# Altium project inst.PrjPcb
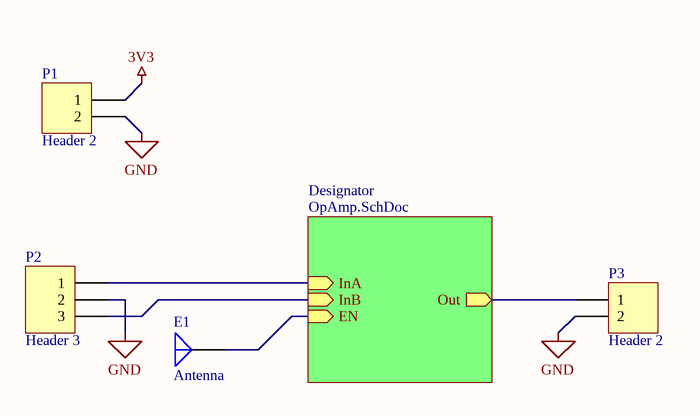
[diagram p0: top.SchDoc]
2 sheets, 38 parts. Net scope: hierarchical (ports join the sheet entries above them; power ports are global).
Board file: PCB1.PcbDoc
Sheets:
  top.SchDoc
    Designator = OpAmp.SchDoc

## Sheet top.SchDoc
size A

### Parts
E1  Antenna  [PIN1]
P1  Header 2  [HEADER 1X2 Male]
P2  Header 3  [HEADER 1X3 MALE]
P3  Header 2  [HEADER 1X2 Male]

### Sub-sheets
Designator = OpAmp.SchDoc: Out (out), InA (in), InB (in), EN (in)

### Nets
3V3: P1.1
GND: P1.2 P2.2 P3.2
NetC6_2: P3.1 ; sheet Designator/Out
NetE1_1: E1.1(A) ; sheet Designator/EN
NetP2_1: P2.1 ; sheet Designator/InA
NetP2_3: P2.3 ; sheet Designator/InB

### Library data of the parts
E1 = Antenna: Generic Antenna; Published: 24-Mar-1999; LatestRevisionDate: 17-Jul-2002; LatestRevisionNote: Re-released for DXP Platform.; PackageReference: PIN1; Publisher: Altium Limited
P1 P3 = Header 2: Header, 2-Pin; LatestRevisionDate: 17-Jul-2002; LatestRevisionNote: Re-released for DXP Platform.; Publisher: Altium Limited
P2 = Header 3: Header, 3-Pin; LatestRevisionDate: 17-Jul-2002; LatestRevisionNote: Re-released for DXP Platform.; Publisher: Altium Limited

## Sheet OpAmp.SchDoc
size A3
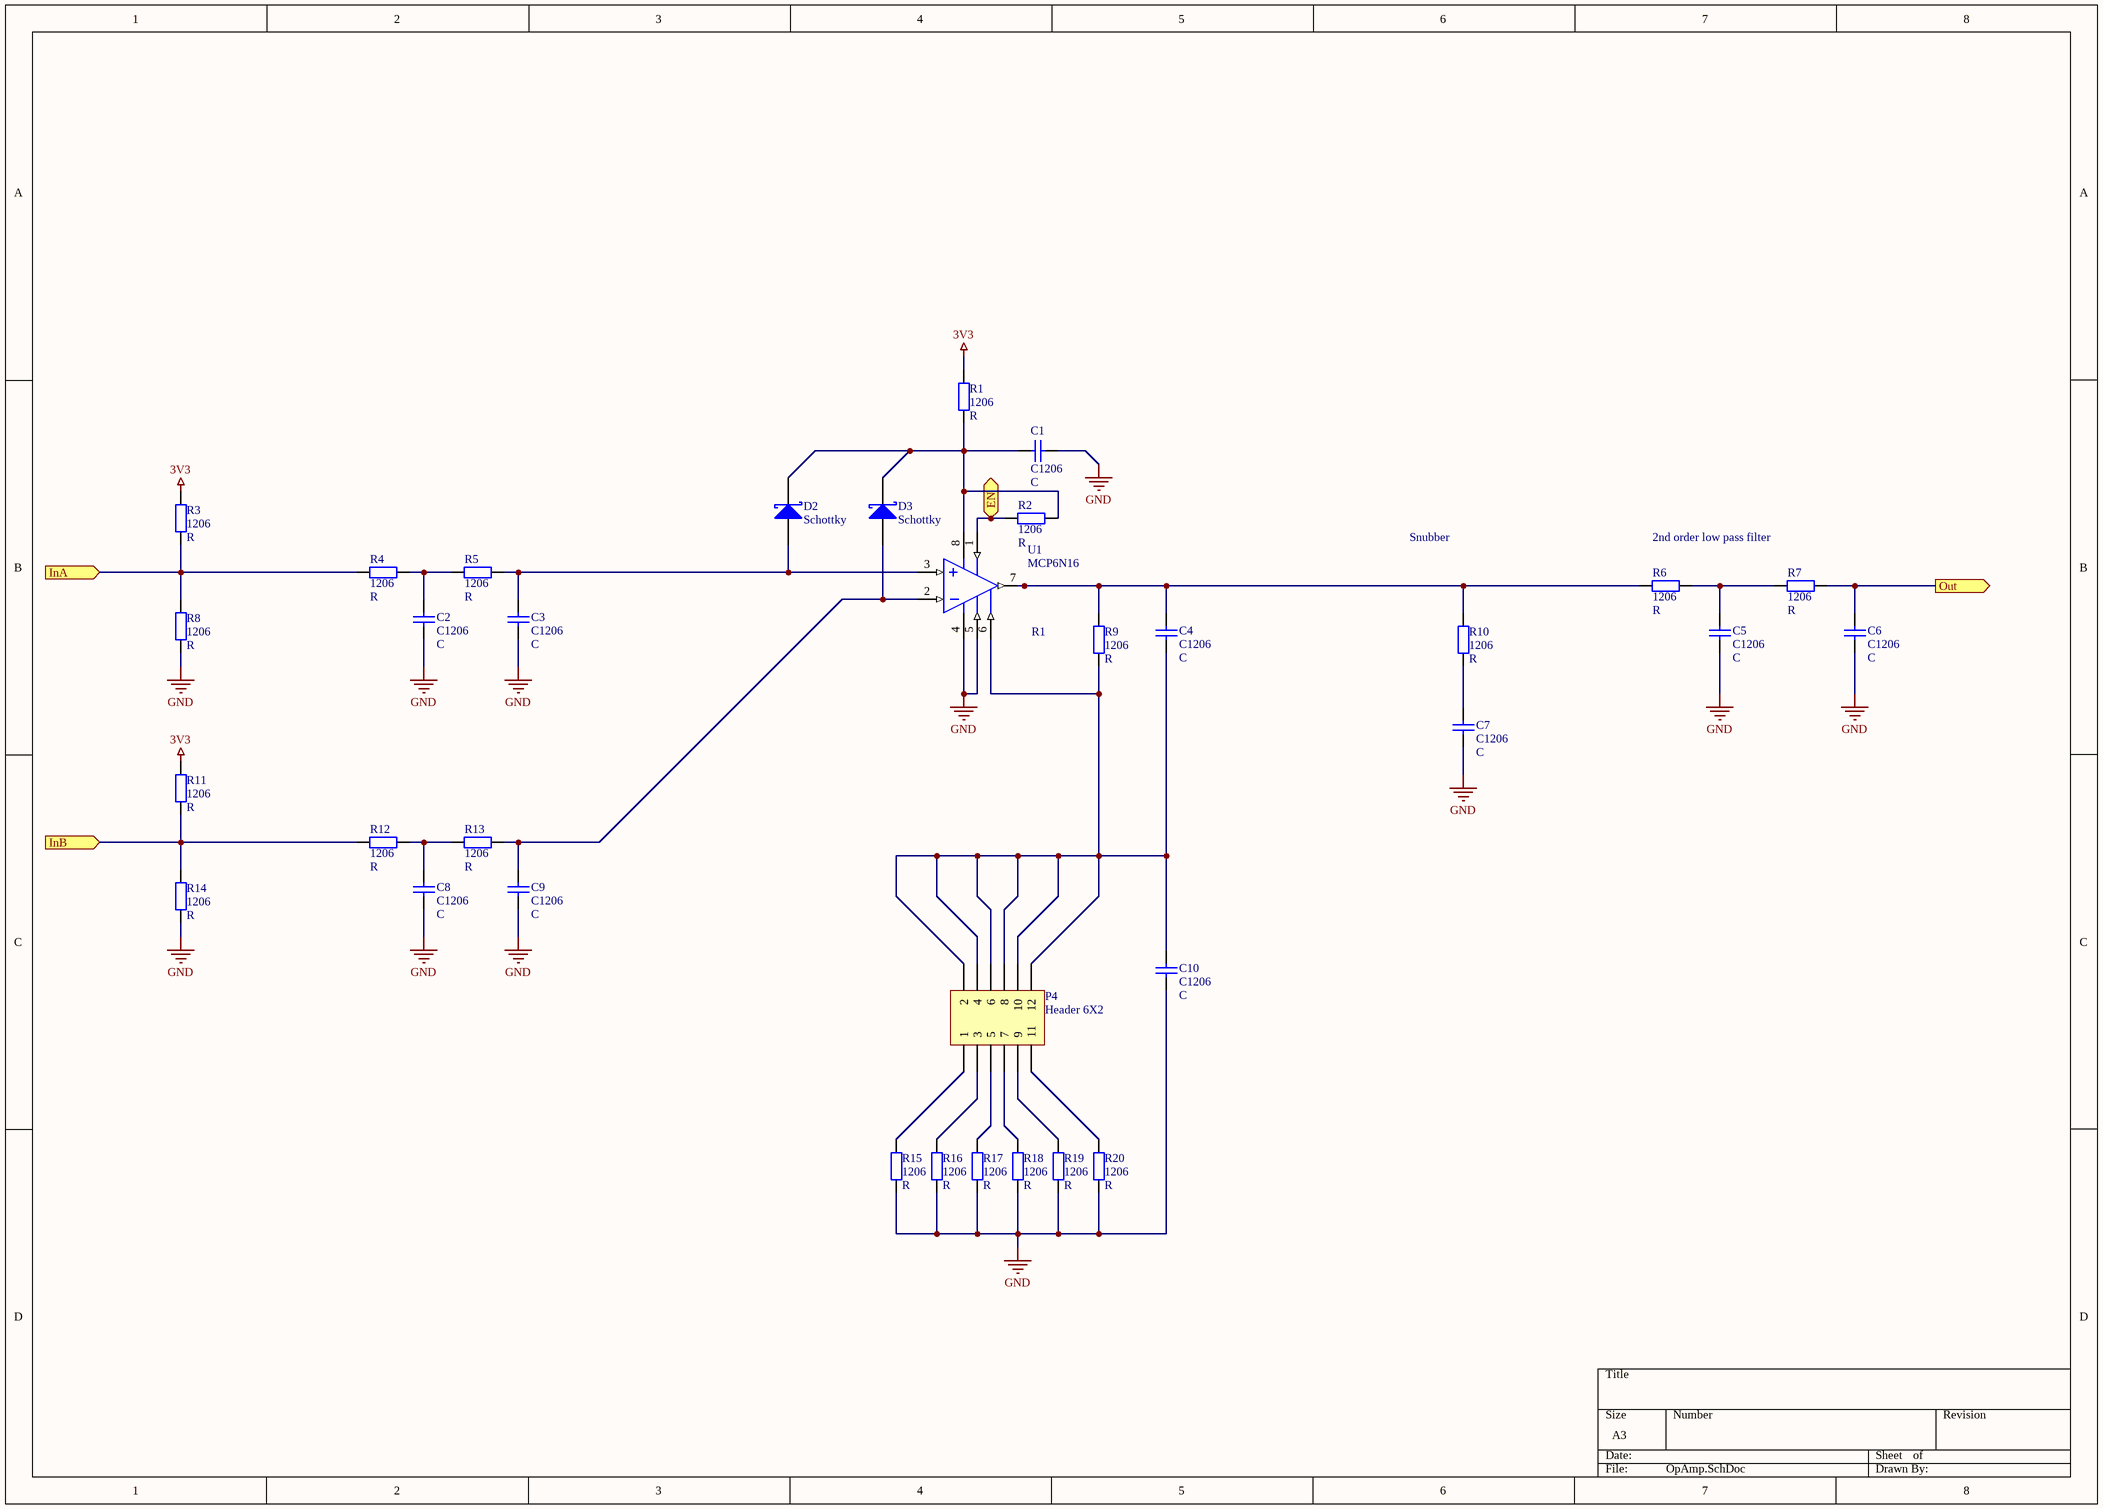
[diagram p1: OpAmp.SchDoc]

### Parts
C1  C  [C1206]
C2  C  [C1206]
C3  C  [C1206]
C4  C  [C1206]
C5  C  [C1206]
C6  C  [C1206]
C7  C  [C1206]
C8  C  [C1206]
C9  C  [C1206]
C10  C  [C1206]
D2  Schottky  [SOD-323]
D3  Schottky  [SOD-323]
P4  Header 6X2  [HEADER 2X6 Male]
R1  R  [1206]
R2  R  [1206]
R3  R  [1206]
R4  R  [1206]
R5  R  [1206]
R6  R  [1206]
R7  R  [1206]
R8  R  [1206]
R9  R  [1206]
R10  R  [1206]
R11  R  [1206]
R12  R  [1206]
R13  R  [1206]
R14  R  [1206]
R15  R  [1206]
R16  R  [1206]
R17  R  [1206]
R18  R  [1206]
R19  R  [1206]
R20  R  [1206]
U1  MCP6N16  [MSOP-MS8_M]

### Ports
EN (in), InA (in), InB (in), Out (out)

### Nets
3V3: R1.2 R3.1 R11.1
GND: C1.2 C2.2 C3.2 C5.1 C6.1 C7.1 C8.2 C9.2 C10.1 R8.2 R14.2 R15.2 R16.2 R17.2 R18.2 R19.2 R20.2 U1.4(VSS) U1.5(Vref)
NetC1_1: C1.1 D2.2(K) D3.2(K) R1.1 R2.2 U1.8(VDD)
NetC2_1: C2.1 R4.2 R5.1
NetC3_1: C3.1 D2.1(A) R5.2 U1.3(VIN+)
NetC4_1: C4.1 C10.2 P4.2 P4.4 P4.6 P4.8 P4.10 P4.12 R9.2 U1.6(FB)
NetC4_2: C4.2 R6.1 R9.1 R10.1 U1.7(VOUT)
NetC5_2: C5.2 R6.2 R7.1
NetC6_2: C6.2 R7.2 ; port Out
NetC7_2: C7.2 R10.2
NetC8_1: C8.1 R12.2 R13.1
NetC9_1: C9.1 D3.1(A) R13.2 U1.2(VIN-)
NetE1_1: R2.1 U1.1(EN) ; port EN
NetP2_1: R3.2 R4.1 R8.1 ; port InA
NetP2_3: R11.2 R12.1 R14.1 ; port InB
NetP4_1: P4.1 R15.1
NetP4_3: P4.3 R16.1
NetP4_5: P4.5 R17.1
NetP4_7: P4.7 R18.1
NetP4_9: P4.9 R19.1
NetP4_11: P4.11 R20.1

### Notes on the sheet
- Snubber
- 2nd order low pass filter
- R1

### Library data of the parts
C1-C10 = Cap: Generic capacitor; Packge: C1206; Value: C
D2 D3 = SchottkyX: Schottky Rectifier
P4 = Header 6X2: Header, 6-Pin, Dual row; LatestRevisionDate: 17-Jul-2002; LatestRevisionNote: Re-released for DXP Platform.; Publisher: Altium Limited
R1-R20 = Res: Generic resistor; Package: 1206; Value: R
U1 = MCP6N16: ComponentLink1URL: http://ww1.microchip.com/downloads/en/DeviceDoc/20005318A.pdf; ComponentLink1Description: Datasheet

## Nets that join several sheets
3V3: top (P1.1), OpAmp (R1.2 R3.1 R11.1)
GND: top (P1.2 P2.2 P3.2), OpAmp (19 pins)
NetC6_2: top (P3.1), OpAmp (C6.2 R7.2)
NetE1_1: top (E1.1), OpAmp (R2.1 U1.1)
NetP2_1: top (P2.1), OpAmp (R3.2 R4.1 R8.1)
NetP2_3: top (P2.3), OpAmp (R11.2 R12.1 R14.1)